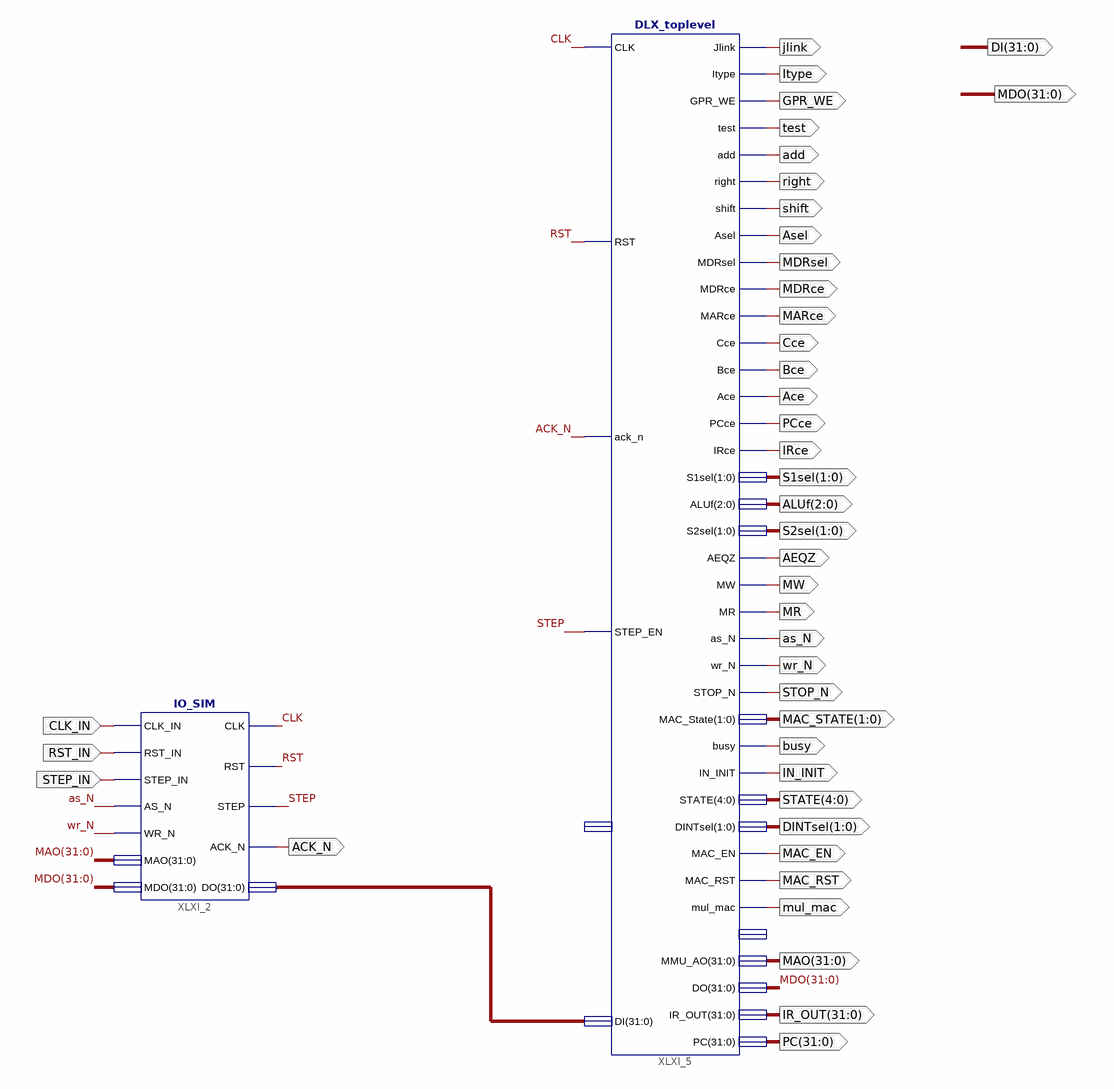
[diagram p0: schematic sheet 1]
// Xilinx ISE schematic DLX_WITH_IOSIM.sch (spartan6) as structural Verilog: 2 symbols, 42 ports
module DLX_WITH_IOSIM (
  input  STEP_IN,
  input  RST_IN,
  input  CLK_IN,
  output as_N,
  output wr_N,
  output ACK_N,
  output [31:0] DI,
  output [31:0] MAO,
  output [31:0] MDO,
  output jlink,
  output Itype,
  output GPR_WE,
  output test,
  output add,
  output right,
  output shift,
  output Asel,
  output MDRsel,
  output MDRce,
  output MARce,
  output Cce,
  output Bce,
  output Ace,
  output PCce,
  output IRce,
  output [1:0] S1sel,
  output [2:0] ALUf,
  output [4:0] STATE,
  output [1:0] S2sel,
  output AEQZ,
  output MW,
  output MR,
  output STOP_N,
  output [1:0] MAC_STATE,
  output busy,
  output IN_INIT,
  output [1:0] DINTsel,
  output [31:0] IR_OUT,
  output [31:0] PC,
  output MAC_EN,
  output MAC_RST,
  output mul_mac
);

  wire CLK, RST, STEP;

  IO_SIM XLXI_2 (
    .CLK_IN(CLK_IN), .RST_IN(RST_IN), .STEP_IN(STEP_IN), .AS_N(as_N), .WR_N(wr_N), .MAO(MAO), .MDO(MDO),
    .CLK(CLK), .RST(RST), .STEP(STEP), .ACK_N(ACK_N), .DO(DI));
  DLX_toplevel XLXI_5 (
    .CLK(CLK), .RST(RST), .ack_n(ACK_N), .STEP_EN(STEP), .DI(DI), .Jlink(jlink), .Itype(Itype),
    .GPR_WE(GPR_WE), .test(test), .add(add), .right(right), .shift(shift), .Asel(Asel), .MDRsel(MDRsel),
    .MDRce(MDRce), .MARce(MARce), .Cce(Cce), .Bce(Bce), .Ace(Ace), .PCce(PCce), .IRce(IRce), .S1sel(S1sel),
    .ALUf(ALUf), .S2sel(S2sel), .AEQZ(AEQZ), .MW(MW), .MR(MR), .as_N(as_N), .wr_N(wr_N), .STOP_N(STOP_N),
    .MAC_State(MAC_STATE), .busy(busy), .IN_INIT(IN_INIT), .STATE(STATE), .DINTsel(DINTsel), .MAC_EN(MAC_EN),
    .MAC_RST(MAC_RST), .mul_mac(mul_mac), .MMU_AO(MAO), .DO(MDO), .IR_OUT(IR_OUT), .PC(PC));  // open: Daddr, D
endmodule
